# EAGLE design PFC_Method_Lighting+Driver_V2 (EAGLE 9.3.0)
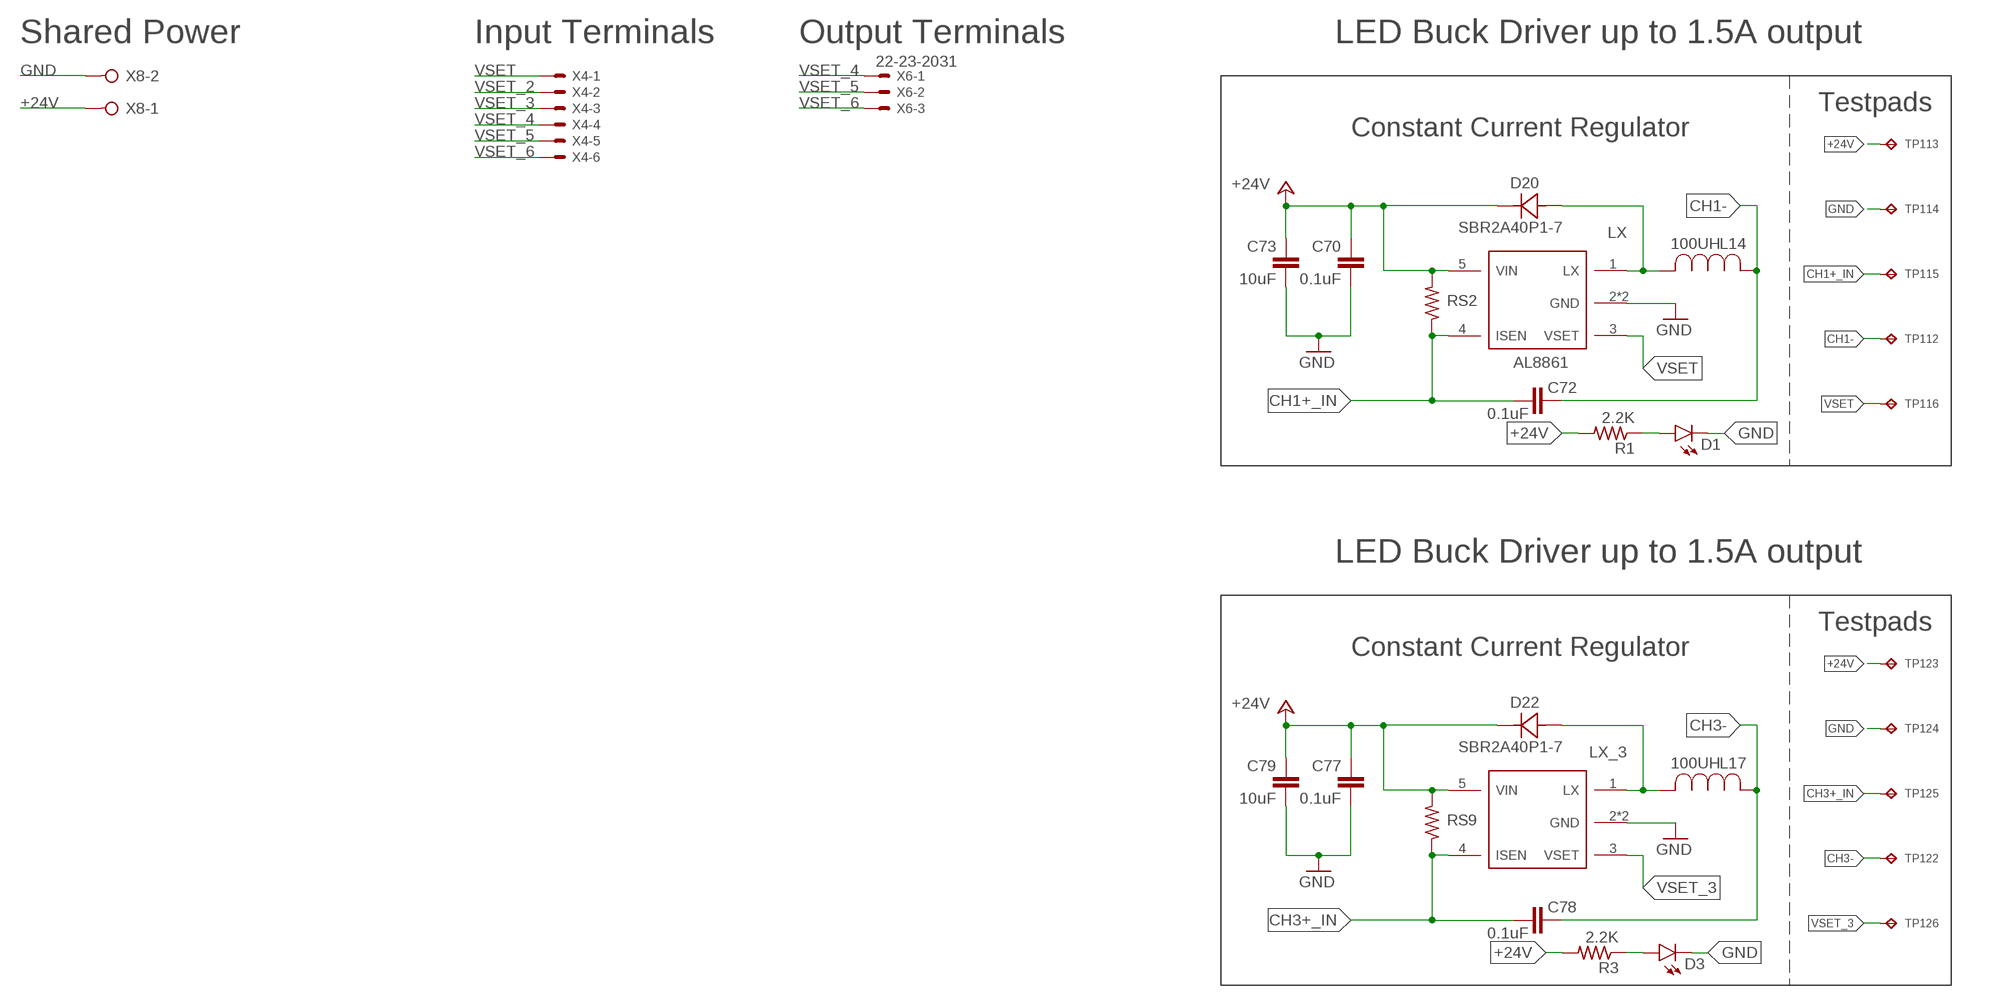
[diagram p0: schematic, sheet 1, part 1 of 2]
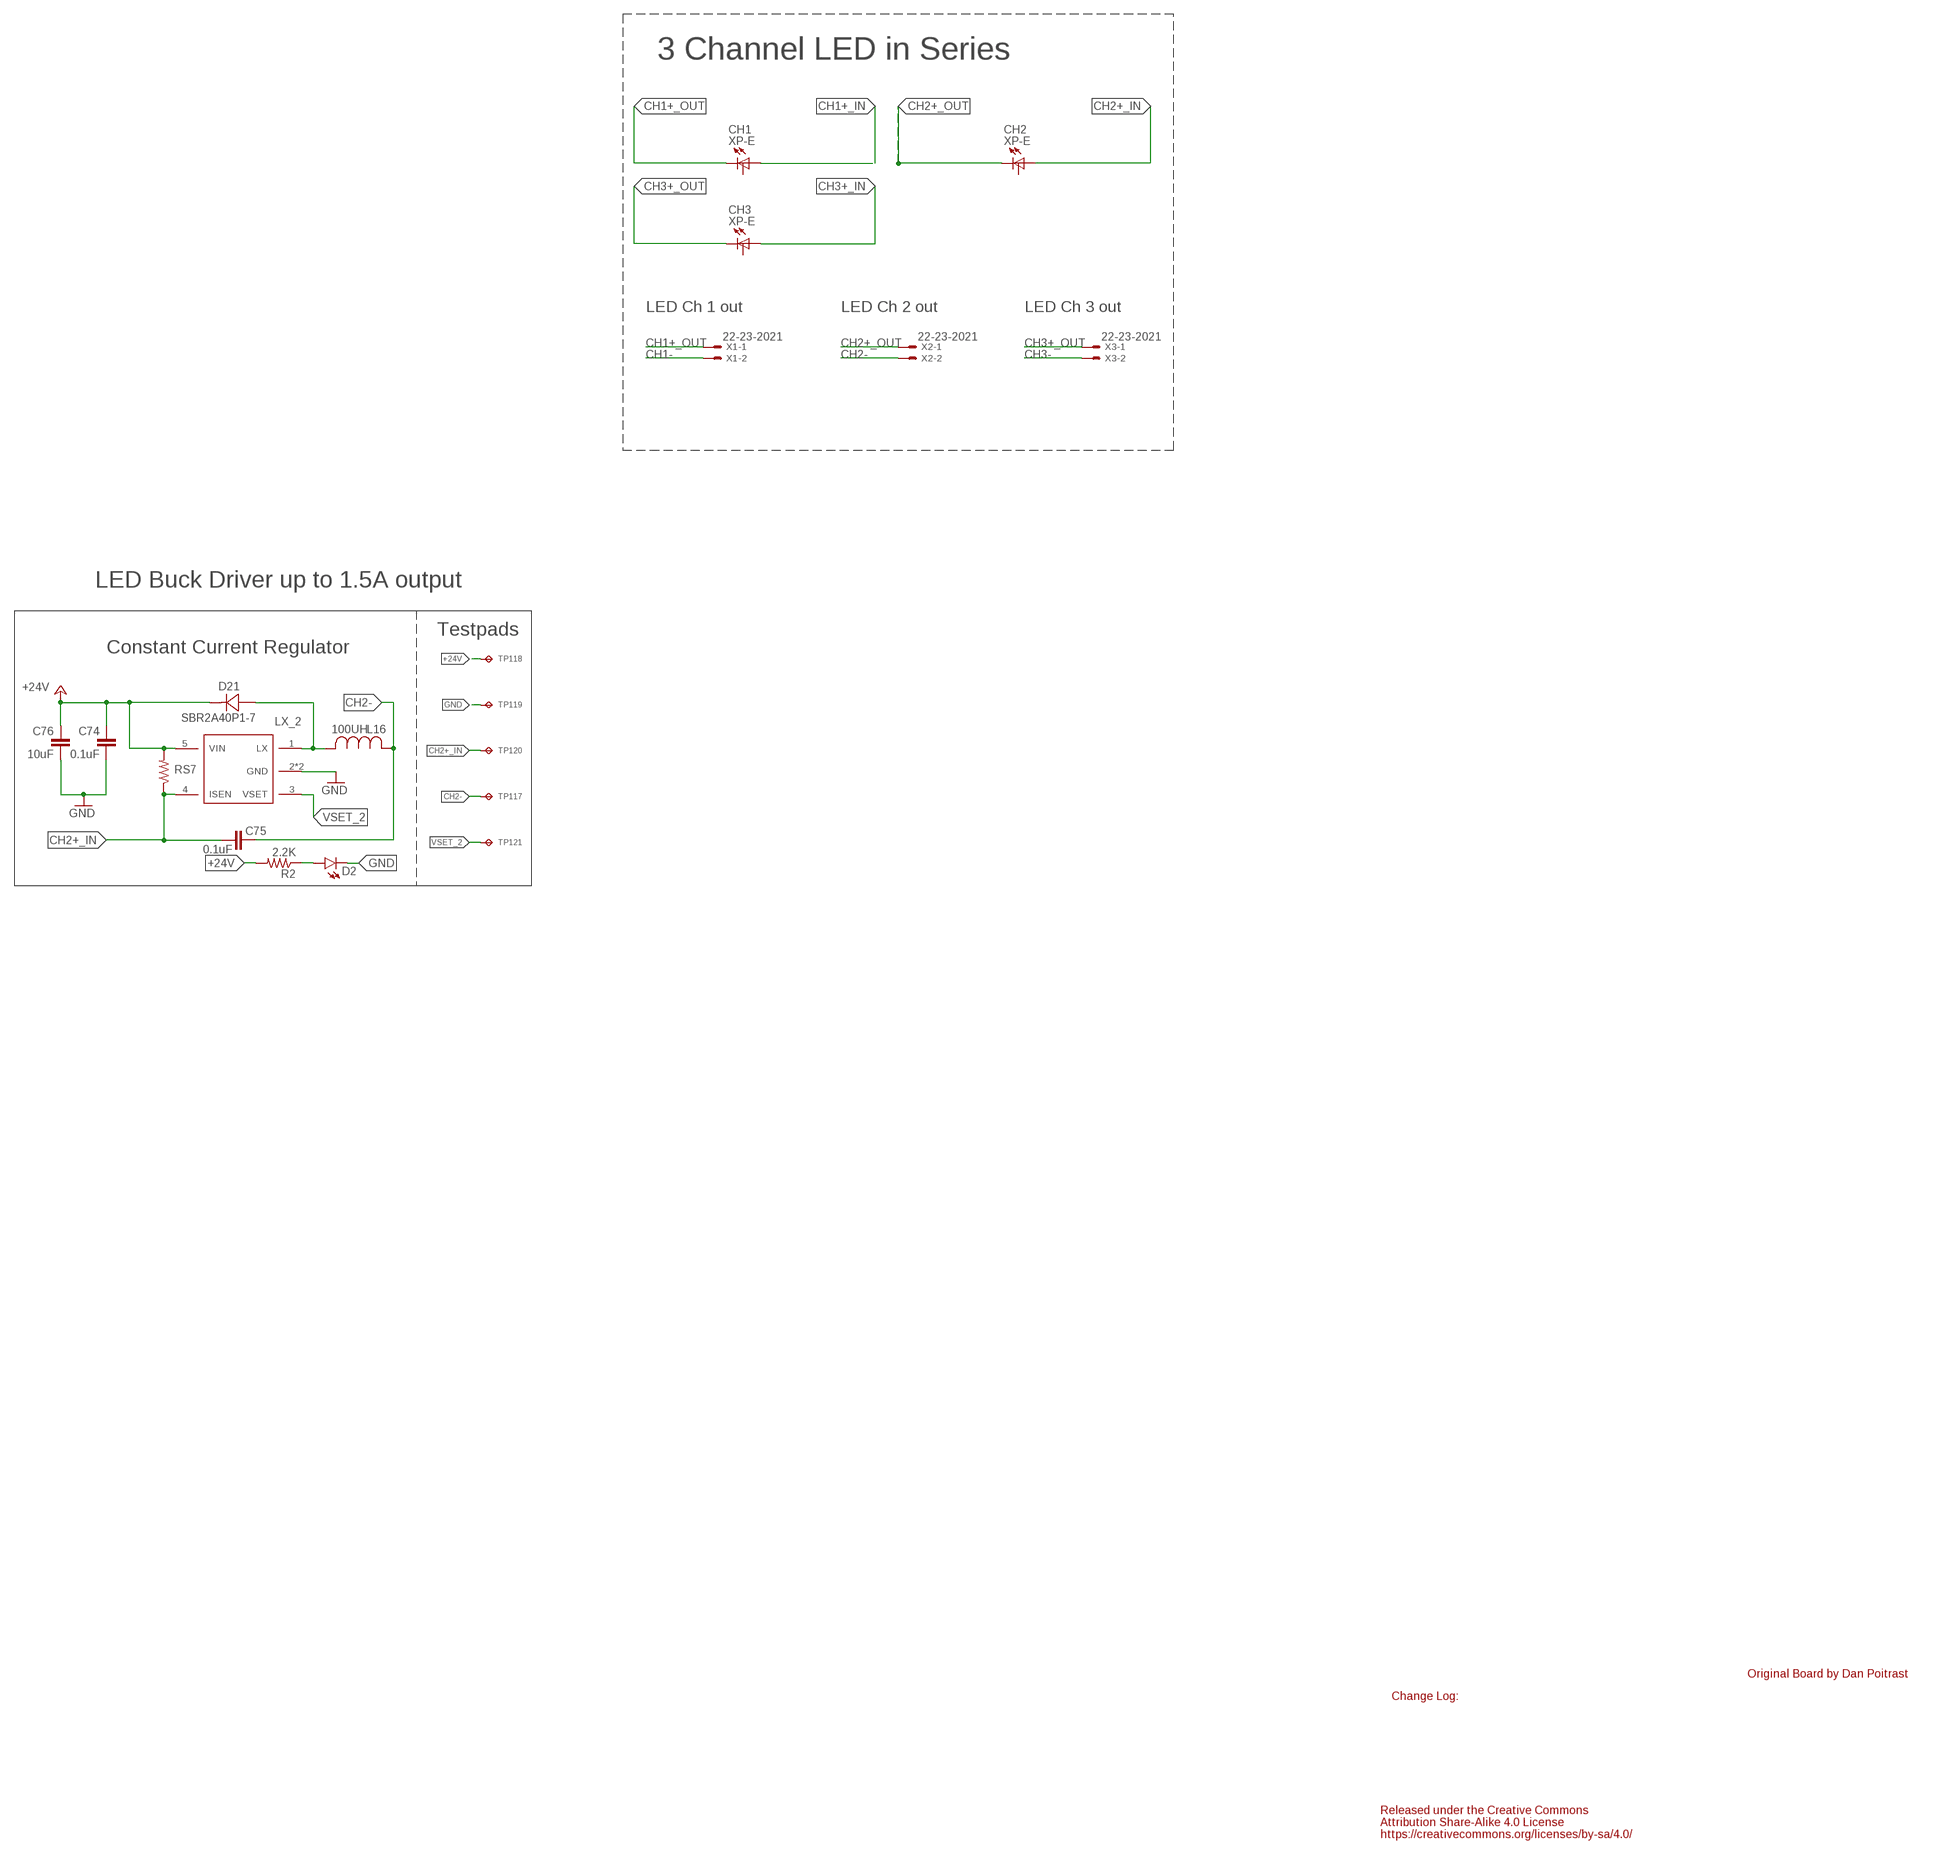
[diagram p1: schematic, sheet 1, part 2 of 2]

## Parts
C70  0.1uF  0.1UF-C0603C104K5RACTU  [C0603]
C72  0.1uF  0.1UF-C0603C104K5RACTU  [C0603]
C73  10uF  10UF-GMK212BBJ106KG-T  [C0805]
C74  0.1uF  0.1UF-C0603C104K5RACTU  [C0603]
C75  0.1uF  0.1UF-C0603C104K5RACTU  [C0603]
C76  10uF  10UF-GMK212BBJ106KG-T  [C0805]
C77  0.1uF  0.1UF-C0603C104K5RACTU  [C0603]
C78  0.1uF  0.1UF-C0603C104K5RACTU  [C0603]
C79  10uF  10UF-GMK212BBJ106KG-T  [C0805]
CH1  XP-E  LED_W/THERM-XP-E  [CREE-XLAMP-XP-E]
CH2  XP-E  LED_W/THERM-XP-E  [CREE-XLAMP-XP-E]
CH3  XP-E  LED_W/THERM-XP-E  [CREE-XLAMP-XP-E]
D1  LED5MM  [LED_5MM]
D2  LED5MM  [LED_5MM]
D3  LED5MM  [LED_5MM]
D20  SBR2A40P1-7  [POWERDI123]
D21  SBR2A40P1-7  [POWERDI123]
D22  SBR2A40P1-7  [POWERDI123]
L14  100UH  100UH_BOURNES  [IND_BOURNS_SDR1307]
L16  100UH  100UH_BOURNES  [IND_BOURNS_SDR1307]
L17  100UH  100UH_BOURNES  [IND_BOURNS_SDR1307]
R1  2.2K  R-US_0207/10  [0207/10]
R2  2.2K  R-US_0207/10  [0207/10]
R3  2.2K  R-US_0207/10  [0207/10]
RS2  6.34Ω  6.3OHM-RC0805FR-076R34L  [R0805]
RS7  6.34 Ω  6.3OHM-RC0805FR-076R34L  [R0805]
RS9  6.34 Ω  6.3OHM-RC0805FR-076R34L  [R0805]
TP112  TPTP06R  [TP06R]
TP113  TPTP06R  [TP06R]
TP114  TPTP06R  [TP06R]
TP115  TPTP06R  [TP06R]
TP116  TPTP06R  [TP06R]
TP117  TPTP06R  [TP06R]
TP118  TPTP06R  [TP06R]
TP119  TPTP06R  [TP06R]
TP120  TPTP06R  [TP06R]
TP121  TPTP06R  [TP06R]
TP122  TPTP06R  [TP06R]
TP123  TPTP06R  [TP06R]
TP124  TPTP06R  [TP06R]
TP125  TPTP06R  [TP06R]
TP126  TPTP06R  [TP06R]
U$25  AL8861  [AL8861]
U$26  AL8861  [AL8861]
U$27  AL8861  [AL8861]
X1  22-23-2021  [22-23-2021]
X2  22-23-2021  [22-23-2021]
X3  22-23-2021  [22-23-2021]
X4  22-23-2061  [22-23-2061]
X6  22-23-2031  [22-23-2031]
X8  W237-02P  [W237-132]

## Nets
+24V: C70.1 C73.1 C74.1 C76.1 C77.1 C79.1 D20.- D21.- D22.- R1.2 R2.2 R3.2 RS2.2 RS7.2 RS9.2 TP113.TP TP118.TP TP123.TP U$25.5(VIN) U$26.5(VIN) U$27.5(VIN) X8.1
CH1+_IN: C72.2 CH1.A CH1.A@1(A) RS2.1 TP115.TP U$25.4(ISEN)
CH1+_OUT: CH1.C CH1.C@1(C) X1.1
CH1-: C72.1 L14.2 TP112.TP X1.2
CH2+_IN: C75.2 CH2.A CH2.A@1(A) RS7.1 TP120.TP U$26.4(ISEN)
CH2+_OUT: CH2.C CH2.C@1(C) X2.1
CH2-: C75.1 L16.2 TP117.TP X2.2
CH3+_IN: C78.2 CH3.A CH3.A@1(A) RS9.1 TP125.TP U$27.4(ISEN)
CH3+_OUT: CH3.C CH3.C@1(C) X3.1
CH3-: C78.1 L17.2 TP122.TP X3.2
GND: C70.2 C73.2 C74.2 C76.2 C77.2 C79.2 D1.K(C) D2.K(C) D3.K(C) TP114.TP TP119.TP TP124.TP U$25.2(GND) U$25.44(GND) U$26.2(GND) U$26.44(GND) U$27.2(GND) U$27.44(GND) X8.2
LX: D20.+ L14.1 U$25.1(LX)
LX_2: D21.+ L16.1 U$26.1(LX)
LX_3: D22.+ L17.1 U$27.1(LX)
N$1: D2.A R2.1
N$2: D1.A R1.1
N$3: D3.A R3.1
VSET: TP116.TP U$25.3(VSET) X4.1
VSET_2: TP121.TP U$26.3(VSET) X4.2
VSET_3: TP126.TP U$27.3(VSET) X4.3
VSET_4: X4.4 X6.1
VSET_5: X4.5 X6.2
VSET_6: X4.6 X6.3
Unconnected: CH1.THERM CH2.THERM CH3.THERM

## Notes on the sheet
- 3 Channel LED in Series
- LED Ch 1 out | LED Ch 2 out | LED Ch 3 out
- Shared Power | Input Terminals | Output Terminals | LED Buck Driver up to 1.5A output | LED Buck Driver up to 1.5A output
- Testpads | Testpads
- Constant Current Regulator | Constant Current Regulator
- AL8861
- LED Buck Driver up to 1.5A output
- Testpads
- Constant Current Regulator
- Original Board by Dan Poitrast
- Change Log:
- Released under the Creative Commons
  Attribution Share-Alike 4.0 License
  https://creativecommons.org/licenses/by-sa/4.0/

## Library data of the parts
C70 C72 C74 C75 C77 C78 = openag-capacitors:0.1UF-C0603C104K5RACTU: CAP CER 0.1UF 50V X7R 0603 Description: 0.1µF ±10% 50V Ceramic Capacitor X7R 0603 (1608 Metric) Technical Specifications: Capacitance: 0.1µF Tolerance: ±10% Rated Voltage: 50V Temperature Coefficient: X7R Operating Temperature: -55°C ~ 125°C Package / Case: 0603 (1608 Metric) Datasheet(s): X7R Dielectric, 6.3-250 VDC <https://search.kemet.com/component-edge/download/datasheet/C0603C104K5RACTU.pdf> Vendor(s): Digikey: 399-5089-1-ND <https://www.digikey.com/product-detail/en/kemet/C0603C104K5RACTU/399-5089-1-ND/1465623>; MANUFACTURER: Kemet; MPN: C0603C104K5RACTU; VENDOR: Digikey; VLINK: https://www.digikey.com/product-detail/en/kemet/C0603C104K5RACTU/399-5089-1-ND/1465623; VPN: 399-5089-1-ND
C73 C76 C79 = openag-capacitors:10UF-GMK212BBJ106KG-T: CAP CER 10UF 35V X5R 0805 Description: 10µF ±10% 35V Ceramic Capacitor X5R 0805 (2012 Metric) Technical Specifications: Capacitance: 10µF Tolerance: ±10% Rated Voltage: 35V Temperature Coefficient: X5R Operating Temperature: -55°C ~ 85°C Package / Case: 0805 (2012 Metric) Datasheet(s): GMK212BBJ106KG-T Spec <http://ds.yuden.co.jp/TYCOMPAS/ut/detail.do?productNo=GMK212BBJ106KG-T&fileName=GMK212BBJ106KG-T_SS&mode=specSheetDownload> Vendor(s): Digikey: 587-4893-1-ND <https://www.digikey.com/product-detail/en/taiyo-yuden/GMK212BBJ106KG-T/587-4893-1-ND/6563736>; MANUFACTURER: Taiyo Yuden; MPN: GMK212BBJ106KG-T; VENDOR: Digikey; VLINK: https://www.digikey.com/product-detail/en/taiyo-yuden/GMK212BBJ106KG-T/587-4893-1-ND/6563736; VPN: 587-4893-1-ND
CH1-CH3 = Tomaszewski:LED_W/THERM
D1-D3 = SparkFun-LED:LED: LED (Generic) Standard schematic elements and footprints for 5mm, 3mm, 1206, and 0603 sized LEDs. Generic LEDs with no color specified.
D20-D22 = openag-diodes:SBR2A40P1-7: DIODE SBR 40V 2A POWERDI123 Description: Diode Super Barrier 40V 2A Surface Mount PowerDI™ 123 Technical Specifications: Diode Type: Super Barrier Voltage - DC Reverse (Vr) (Max): 40V Current - Average Rectified (Io): 2A Voltage - Forward (Vf) (Max) @ If: 500mV @ 2A Speed: Standard Recovery >500ns, > 200mA (Io) Current - Reverse Leakage @ Vr: 100µA @ 40V Mounting Type: Surface Mount Package / Case: POWERDI®123 Supplier Device Package: PowerDI™ 123 Operating Temperature - Junction: -65°C ~ 150°C Base Part Number: SBR2A40 Datasheet(s): SBR2A40P1 <https://www.diodes.com/assets/Datasheets/SBR2A40P1.pdf> Vendor(s): Digikey: SBR2A40P1DITR-ND <https://www.digikey.com/product-detail/en/diodes-incorporated/SBR2A40P1-7/SBR2A40P1DITR-ND/1681825>; MANUFACTURER: Diodes Incorporated; MPN: SBR2A40P1-7; VENDOR: Digikey; VLINK: https://www.digikey.com/product-detail/en/diodes-incorporated/SBR2A40P1-7/SBR2A40P1DITR-ND/1681825; VPN: SBR2A40P1DITR-ND
L14 L16 L17 = openag-inductors:100UH_BOURNES: Bourne - FIXED IND 100UH 1.9A 180 MOHM Technical Specifications: Inductance: 100uH Rated Current: 1.9A Saturation Current: 3.0A DC Resistance: 180mΩ Operating Temperature: -40° C to 125°C Datasheet(s): 100uH Bourne <http://www.bourns.com/docs/Product-Datasheets/SDR1307.pdf> Vendors: Digikey: SDR1307-101KLCT-ND <https://www.digikey.com/product-detail/en/bourns-inc/SDR1307-101KL/SDR1307-101KLCT-ND/3437739>
R1-R3 = rcl:R-US_: RESISTOR, American symbol; SPICEPREFIX: R
RS2 RS7 RS9 = openag-resistors:6.3OHM-RC0805FR-076R34L: Yageo - RC0805FR-076R34L - RES SMD 6.34 OHM 1% 1/8W 0805 Description: 6.34 Ohms ±1% 0.125W, 1/8W Chip Resistor 0805 (2012 Metric) Moisture Resistant Thick Film Technical Specifications: Resistance: 6.34 Ohms Tolerance: ±1% Power: 0.125W, 1/8W Temperature Coefficient: ±200ppm/°C Operating Temperature: -55°C ~ 155°C Packaging / Case: 0805 (2012 Metric) Datasheet(s): RC Series, L Datasheet Vendor(s): Digikey: 311-6.34CRCT-ND <https://www.digikey.com/product-detail/en/yageo/RC0805FR-076R34L/311-6.34CRCT-ND/731003>; POPULATE: YES; VALUE: 6.34 ohm; VERIFIED: NO
TP112-TP126 = openag-testpads:TP: Test pad; MPN: N/A
U$25-U$27 = openag-driver-IC:AL8861: AL8861 LED Driver IC Description: IC LED DRVR REG PWM 1.5A SOT89-5 Technical Specifications: Type: IC Voltage In: 4.5V - 40V Current Out: Up to 1.5A Frequency: 1Mhz Dimming: PWM or Analog Package SOT-89-5 Operating Temperature: -40°C ~ 85°C (TA) Datasheet(s): Diodes AL8861 <https://www.mouser.com/ds/2/115/AL8861-1094677.pdf> Vendor(s): Digikey: Diodes AL8861 <https://www.digikey.com/product-detail/en/diodes-incorporated/AL8861Y-13/AL8861Y-13DICT-ND/6702378>
X1-X3 = con-molex:22-23-2021: .100" (2.54mm) Center Header - 2 Pin; MF: MOLEX; MPN: 22-23-2021; OC_FARNELL: 1462926; OC_NEWARK: 25C3832
X4 = con-molex:22-23-2061: .100" (2.54mm) Center Header - 6 Pin; MF: MOLEX; MPN: 22-23-2061; OC_FARNELL: 1462922; OC_NEWARK: 27C1933
X6 = con-molex:22-23-2031: .100" (2.54mm) Center Header - 3 Pin; MF: MOLEX; MPN: 22-23-2031; OC_FARNELL: 1462950; OC_NEWARK: 30C0862
X8 = con-wago-508:W237-02P: WAGO SREW CLAMP; OC_FARNELL: unknown; OC_NEWARK: unknown

## Net classes
0 default: width 0.305 mm, drill 0.254 mm, clearance 0.254 mm

## Board
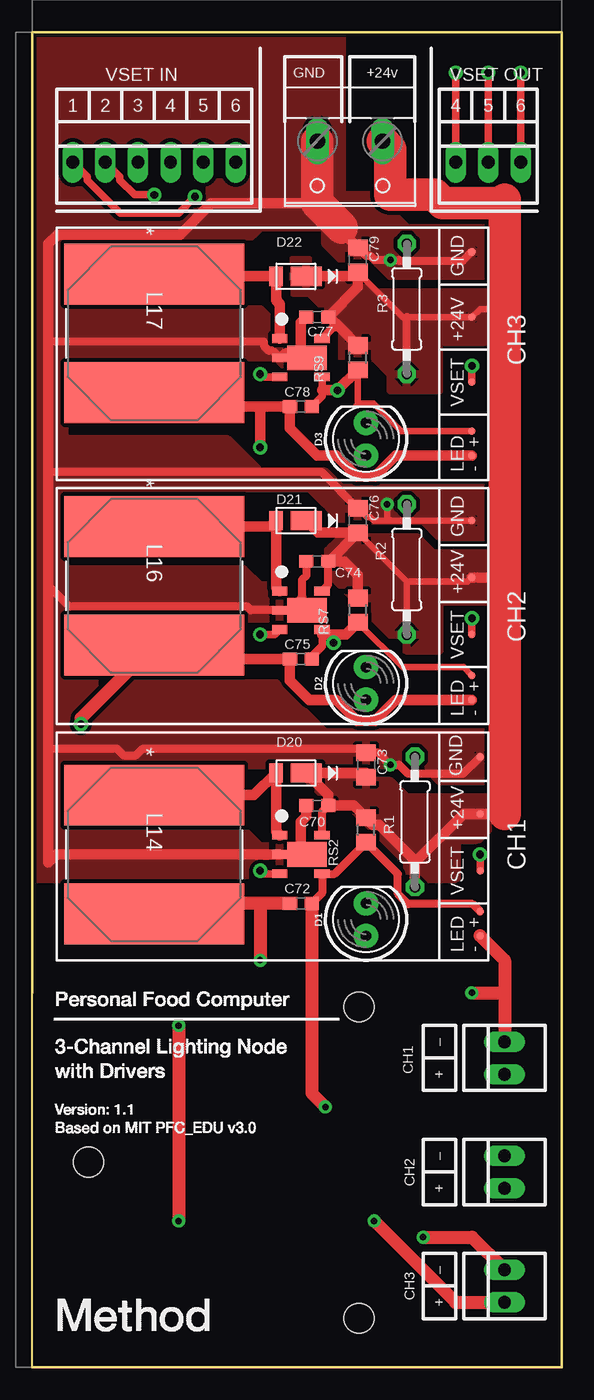
[diagram p2: board, top side]
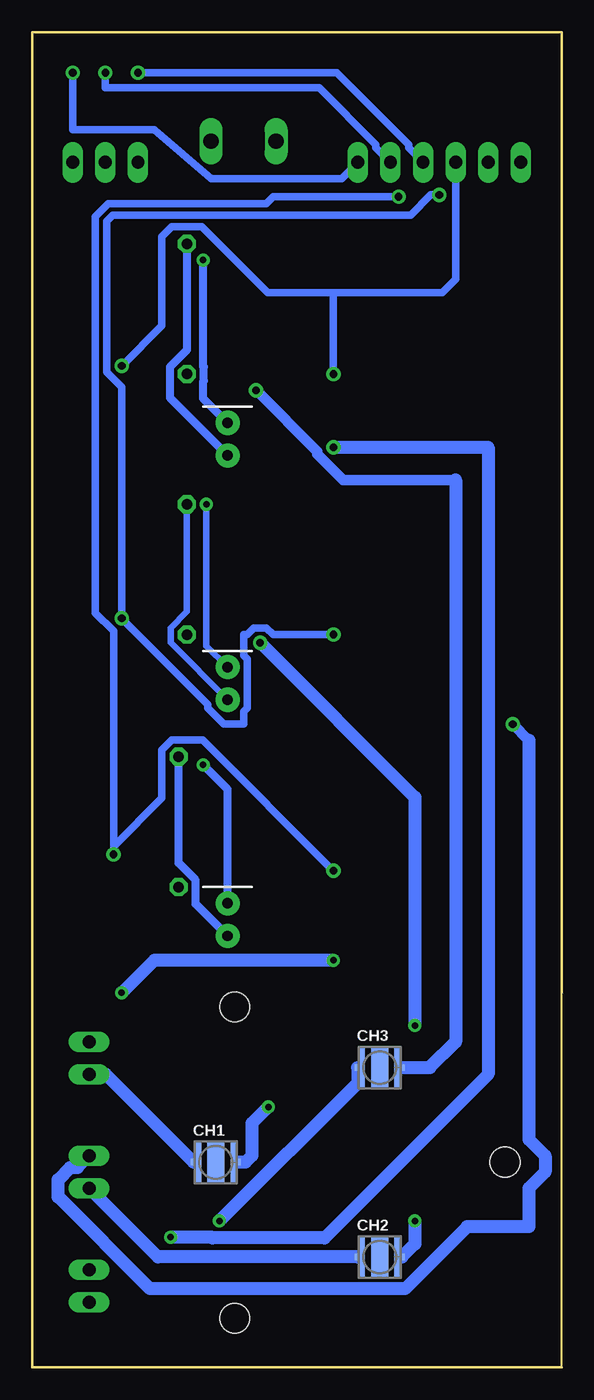
[diagram p3: board, bottom side, seen from below]

Size 41.27 x 104.14 mm. Coordinates in mm from the lower left corner, seen from the top.
Outline: 0,0 0,29.21 0,104.14 41.27,104.14 41.27,0 0,0
Copper layers (1*16): Top 0.035mm / dielectric 1.5mm / Bottom 0.035mm
Design rules "SparkFun *": minimum track width 8mil, minimum drill 20mil, track to track 12mil, track to pad 12mil, pad to pad 12mil, via to via 12mil, smd to smd 8mil, copper to edge 10mil, drill to drill 8mil, minimum pad ring 12mil, minimum via ring 10mil, stop-mask expansion 4mil, vias tented up to drill 25mil, thermal gap 10mil
Holes 2.35 mm at 25.48,28.12 4.39,16 25.48,3.84

### Footprints (pad centres in the part's own frame; a part is rotated, then mirrored left to right if it is on the bottom)
C0603 = smd 1.1 x 1: 1 -0.85,0; 2 0.85,0
C0805 = smd 1.3 x 1.5: 1 -0.95,0; 2 0.95,0
CREE-XLAMP-XP-E = smd 0.5 x 3.3: A 1.4,0; C -1.4,0 | smd 0.45 x 0.5: A@1 1.725,0; C@1 -1.725,0 | smd 1.3 x 3.3: THERM 0,0
LED_5MM = drill 0.813 pad 1.88: A -1.27,0; K 1.27,0
POWERDI123 = smd 1.05 x 1.5: + -1.3,0 | smd 2.4 x 1.5: - 1.05,0
IND_BOURNS_SDR1307 = smd 4.75 x 13.995: 1 -4.623,0; 2 4.623,0
0207/10 = drill 0.813 octagon: 1 -5.08,0; 2 5.08,0
R0805 = smd 1.3 x 1.5: 1 -0.95,0; 2 0.95,0
TP06R = smd 0.6 x 0.6: TP 0,0
AL8861 = smd 0.68 x 1.2: 1 -1.5,-1.65; 2 0,-1.65; 3 1.5,-1.65; 4 1.5,1.65; 5 -1.5,1.65 | smd 1.93 x 3.05: 44 0,0.475
22-23-2021 = drill 1 long: 1 -1.27,0; 2 1.27,0
22-23-2061 = drill 1 long: 1 -6.35,0; 2 -3.81,0; 3 -1.27,0; 4 1.27,0; 5 3.81,0; 6 6.35,0
22-23-2031 = drill 1 long: 1 -2.54,0; 2 0,0; 3 2.54,0
W237-132 = drill 1.194 long: 1 -2.54,-0.635; 2 2.54,-0.635

### Placement (x,y rotation side)
C70  22.23,43.81 180 top
C72  20.95,36.2 0 top
C73  26.04,46.99 90 top
C74  22.23,62.87 180 top
C75  20.95,55.24 0 top
C76  25.4,66.04 90 top
C77  22.23,81.91 180 top
C78  20.95,74.93 0 top
C79  25.4,86.36 90 top
CH1  26.95,16 0 bottom
CH2  14.17,8.61 0 bottom
CH3  14.17,23.39 0 bottom
D1  26.04,34.93 90 top
D2  26.04,53.34 90 top
D3  26.04,72.39 90 top
D20  20.32,46.36 0 top
D21  20.32,66.04 0 top
D22  20.32,85.09 0 top
L14  9.53,40.01 270 top
L16  9.53,60.96 270 top
L17  9.53,80.64 270 top
R1  29.84,42.55 270 top
R2  29.21,62.23 270 top
R3  29.21,82.55 270 top
RS2  26.04,41.91 90 top
RS7  25.4,59.05 90 top
RS9  25.4,78.74 90 top
TP112  34.92,33.66 0 top
TP113  34.29,61.6 90 top
TP114  34.29,66.04 90 top
TP115  34.92,35.56 0 top
TP116  34.92,38.73 0 top
TP117  34.29,52.07 90 top
TP118  34.29,81.91 0 top
TP119  34.29,86.99 0 top
TP120  34.29,53.98 90 top
TP121  34.29,57.15 90 top
TP122  34.29,71.12 0 top
TP123  34.92,43.18 0 top
TP124  34.92,47.62 0 top
TP125  34.29,73.02 0 top
TP126  34.29,76.83 0 top
U$25  20.95,40.01 270 top
U$26  20.95,59.05 270 top
U$27  20.95,78.74 270 top
X1  36.83,24.13 90 top
X2  36.83,15.24 90 top
X3  36.83,6.35 90 top
X4  9.53,93.98 0 top
X6  35.56,93.98 0 top
X8  24.79,95 180 top

### Tracks (layer width: path | path; a pad name or v marks a point on that pad's centre or on a via)
+24V
  Top 0.508: 36.83,82.55 34.92,82.55 TP118.TP 29.21,81.91 28.89,81.91 C79.1 | R2.2 29.21,61.28 | 29.21,61.28 C76.1 | 29.21,61.28 33.98,61.28 TP113.TP
  Top 0.61: R3.2 29.21,81.91 | U$27.5 23.48,81.12 23.97,81.12 | U$26.5 23.07,61.02 C74.1 | U$25.5 22.61,43.34 C70.1
  Top 0.813: C73.1 26.01,46.36 D20.- 23.07,44.65 C70.1 25.08,43.81 RS2.2 26.57,42.32 27.08,42.32 29.84,39.56 29.84,39.37 | D21.- 22.32,65.09 C76.1 23.18,62.87 C74.1 24.34,62.87 25.4,61.81 RS7.2 | C79.1 25.4,85.09 | 25.4,85.09 25.4,84.24 C77.1 23.18,81.91 23.97,81.12 RS9.2 | D22.- 25.4,85.09 | 29.53,37.47 R1.2 29.84,39.37 | 29.84,39.37 33.66,43.18 TP123.TP 36.83,43.18 | TP113.TP 36.2,61.6 36.83,60.96
  Top 2.54: X8.1 27.94,95.02 27.94,91.44 31.39,91.44 32.03,90.8 36.55,90.8 36.83,91.08 36.83,82.55 36.83,60.96 36.83,43.18
  pour Top: 35.56,83.82 26.67,83.82 25.4,85.09 22.86,85.09 21.59,86.36 20.32,86.36 20.32,83.82 21.59,83.82 24.13,81.28 24.13,78.74 26.67,78.74 27.94,77.47 27.94,76.2 31.75,76.2 31.75,80.01 35.56,80.01
  pour Top: 35.56,63.5 35.56,59.69 31.75,59.69 31.75,55.88 29.21,55.88 26.67,58.42 26.67,59.69 25.4,59.69 22.86,62.23 22.86,63.5 24.13,64.77 29.97,64.77 31.24,63.5
  pour Top: 35.56,44.45 31.75,44.45 29.21,44.45 27.94,45.72 21.59,45.72 22.86,44.45 24.13,44.45 25.4,43.18 29.21,39.37 29.21,38.1 33.02,38.1 33.15,38.23 33.15,41.15 34.8,41.15 35.56,41.91
CH1+_IN  (via drill 0.51)
  Top 0.61: TP115.TP 34.34,36.14 29.3,36.14 28.51,36.93 28.51,38.48 RS2.1 23.58,38.51 U$25.4 22.61,36.99 C72.2
  Top 1.016: C72.2 21.8,21.38 v22.86,20.32
  Bottom 1.016: v22.86,20.32 24.13,19.05 24.13,16.51 24.64,16 CH1.A@1
CH1+_OUT
  Bottom 0.6: CH1.C CH1.C@1
  Bottom 1.016: CH1.C@1 35.53,22.86 X1.1
CH1-  (via drill 0.51)
  Top 0.813: L14.2 10.34,36.2 12.7,36.2
  Top 1.016: C72.1 17.78,36.2 | 17.78,36.2 12.7,36.2 | TP112.TP 36.83,31.75 36.83,29.21 | 36.83,29.21 X1.2 | 17.78,36.2 v17.78,31.75 | v34.29,29.21 36.83,29.21
  Bottom 1.016: v17.78,31.75 31.75,31.75 v34.29,29.21
CH2+_IN  (via drill 0.51, 0.6)
  Top 0.508: TP120.TP 33.66,54.61 28.89,54.61 RS7.1
  Top 0.6: U$26.4 22.61,57.15 22.61,56.26
  Top 0.61: C75.2 21.8,55.46 22.61,56.26
  Top 0.813: RS7.1 24.45,57.15 23.5,57.15 | 23.5,57.15 22.61,57.15 | 23.5,57.15 v23.5,56.52
  Top 1.016: v11.43,26.67 v11.43,11.43
  Bottom 1.016: v23.5,56.52 11.43,44.45 v11.43,26.67 | v11.43,11.43 11.43,9.63 CH2.A@1
CH2+_OUT
  Bottom 1.016: CH2.C@1 31.47,8.61 X2.1
CH2-  (via drill 0.6)
  Top 0.813: L16.2 10.62,55.24 C75.1 20.11,53.55 21.59,52.07 23.7,52.07 25.35,50.42 26.72,50.42 28.37,52.07 TP117.TP | 3.81,50.62 v3.81,50.16
  Top 1.016: L16.2 3.81,50.62
  Bottom 0.813: v3.81,50.16 2.54,48.9
  Bottom 1.016: 2.54,48.9 2.54,17.78 1.27,16.51 1.27,15.24 2.54,13.97 2.54,10.98 7.35,10.98 12.19,6.15 32.1,6.15 39.25,13.3 39.25,14.64 38.3,15.59 37.75,15.59 X2.2
CH3+_IN  (via drill 0.6)
  Top 0.508: RS9.1 25.4,75.14 | 25.4,75.14 25.29,75.04 | 25.4,75.14 25.41,75.16 26.66,75.16 28.79,73.02 TP125.TP
  Top 0.6: U$27.4 22.61,76.2 22.61,75.73 C78.2
  Top 0.813: RS9.1 v23.81,76.2 22.61,76.2
  Bottom 0.813: v23.81,76.2 19.05,71.43 19.05,71.23 17.03,69.21 8.26,69.21
  Bottom 1.016: 8.26,69.21 8.26,25.4 | 8.26,25.4 8.26,25.37 | CH3.A@1 10.26,23.39 8.26,25.4
CH3+_OUT  (via drill 0.51)
  Top 1.016: v26.67,11.43 33.02,5.08 X3.1
  Bottom 1.016: CH3.C@1 15.9,22.2 v26.67,11.43
CH3-  (via drill 0.51, 0.6)
  Top 0.813: L17.2 14.78,76.02 15.88,74.93 17.78,74.93 | 17.78,74.93 C78.1 20.11,73.24 22.23,71.12 23.7,71.12 25.35,69.47 26.72,69.47 28.37,71.12 TP122.TP | 17.78,74.93 v17.78,71.75
  Top 1.016: v30.48,10.16 34.29,10.16 X3.2
  Bottom 1.016: v17.78,71.75 5.71,71.75 5.71,22.86 18.47,10.11 27.22,10.11 27.27,10.16 v30.48,10.16
GND  (via drill 0.51)
  Top 0.508: TP114.TP 27.94,66.04 | 27.94,66.04 26.64,66.04 26.38,66.3 26.09,66.3 C76.2 | v27.69,67.31 27.69,66.29 27.94,66.04
  Top 0.61: 1.27,60.96 2.91,59.32 16.77,59.32 17.04,59.05 U$26.2 U$26.44 21.43,59.22 20.83,59.82 21.08,60.07 21.08,61.47 21.38,61.76 C74.2 | 1.27,69.85 22.54,69.85 C76.2 | 1.27,48.26 6.61,48.26 7.14,47.73 8.1,47.73 8.63,48.26 25.71,48.26 C73.2 26.99,47.94 v27.94,46.99 28.61,46.99 29.3,46.3 33.6,46.3 TP124.TP | C79.2 26.04,86.67 26.4,86.67 26.71,86.36 v27.94,86.36 28.61,86.36 28.66,86.31 33.6,86.31 TP119.TP | 1.27,80.01 18.04,80.01 18.09,79.95 18.09,79.65 18.45,79.29 18.75,79.29 U$27.2 19.78,79.21 20.95,79.21 | U$25.2 U$25.44 21.43,40.16 20.95,40.64
  Top 0.813: C70.2 21.38,42.97 20.95,42.55 20.95,40.64 | C77.2 20.95,81.49 20.95,79.21 U$27.44 | C79.2 24.13,88.58 24.13,88.9 | 22.25,90.78 13.97,90.78 11.55,88.35 1.99,88.35 1.27,87.63 1.27,80.01 1.27,69.85 1.27,60.96 1.27,48.26 1.27,39.37 1.91,40.01 U$25.2
  Top 2.54: X8.2 22.25,90.78 24.13,88.9
  Bottom 0.508: D2.K 27.69,56.26 v27.69,67.31
  Bottom 0.61: D3.K 27.94,75.56 27.94,76.87 27.89,76.92 27.89,78.02 27.94,78.07 v27.94,86.36 | D1.K 26.04,45.09 v27.94,46.99
  pour Top: 0,104.14 24.13,104.14 24.13,88.9 17.78,88.9 16.51,87.63 2.54,87.63 2.54,82.55 17.78,82.55 20.32,80.01 20.32,77.47 19.05,78.74 15.24,78.74 2.54,78.74 0,78.74
  pour Top: 0,80.01 0,38.1 20.32,38.1 20.32,40.64 17.78,40.64 16.51,41.91 2.54,41.91 2.54,46.99 26.67,46.99 30.48,46.99 31.75,45.72 35.56,45.72 35.56,49.53 22.86,49.53 19.05,53.34 2.54,53.34 2.54,58.42 20.32,58.42 20.32,60.96 17.78,60.96 16.51,62.23 2.54,62.23 2.54,68.58 21.59,68.58 24.13,66.04 30.48,66.04 31.75,64.77 35.56,64.77 35.56,68.58 24.13,68.58 22.86,69.85 17.78,69.85 15.24,72.39 2.54,72.39 2.54,80.01
  pour Top: 24.13,91.44 26.67,91.44 29.21,88.9 35.56,88.9 35.56,85.09 27.94,85.09 26.67,86.36 24.13,86.36 22.86,87.63 22.86,91.44
LX
  Top 0.813: U$25.1 19.02,41.79 D20.+ 17.29,44.63 L14.1
LX_2
  Top 0.813: L16.1 18.56,65.58 D21.+ 19.02,60.84 U$26.1
LX_3
  Top 0.813: L17.1 9.7,85.09 D22.+ 19.02,83.21 19.3,82.93 U$27.1
N$1
  Bottom 0.508: R2.1 29.21,58.95 30.48,57.68 30.48,56.52 D2.A
N$2
  Bottom 0.61: D1.A 28.52,36.14 28.52,38.01 29.84,39.33 R1.1
N$3
  Bottom 0.61: R3.1 29.21,79.34 30.53,78.02 30.53,75.62 D3.A
VSET  (via drill 0.6)
  Top 0.6: U$25.3 18.01,38.51 v17.78,38.73 | v34.92,40.01 TP116.TP | X4.1 4.3,92.85 4.3,92.59 6.87,90.03 11.43,90.03 v12.7,91.3
  Bottom 0.6: 34.92,40.64 34.92,57.42 36.35,58.84 36.35,89.75 35.35,90.76 23,90.76 22.46,91.3 v12.7,91.3 | 34.92,40.64 31.16,44.4 31.16,48.17 30.39,48.94 27.99,48.94 v17.78,38.73 | v34.92,40.01 34.92,40.64
VSET_2  (via drill 0.6)
  Top 0.6: U$26.3 18.9,57.15 v17.78,57.15 | v34.29,58.42 TP121.TP | X4.2 6.84,92.85 6.84,92.59 8,91.44 v9.53,91.44
  Bottom 0.6: v17.78,57.15 22.49,57.15 23.02,57.67 23.98,57.67 24.5,57.15 24.77,57.15 24.77,55.52 24.49,55.25 24.49,51.43 24.77,51.16 24.77,50.16 26.31,50.16 27.58,51.43 27.58,51.71 v34.29,58.42 34.29,76.47 35.45,77.62 35.45,89.38 34.98,89.85 11.77,89.85 10.18,91.44 v9.53,91.44
VSET_3  (via drill 0.6)
  Top 0.6: U$27.3 18.01,77.24 v17.78,77.47 | v34.29,78.1 TP126.TP
  Bottom 0.6: 17.78,83.82 v17.78,77.47 | X4.3 8.26,84.87 9.3,83.82 17.78,83.82 | 17.78,83.82 22.9,83.82 28.03,88.95 30.39,88.95 31.16,88.17 31.16,81.23 v34.29,78.1
VSET_4  (via drill 0.6)
  Top 0.6: v33.02,100.96 X6.1
  Bottom 0.6: X4.4 11.93,95.11 11.93,95.37 17.52,100.96 v33.02,100.96
VSET_5  (via drill 0.6)
  Top 0.6: v35.56,100.96 X6.2
  Bottom 0.6: X4.5 14.46,95.11 14.46,95.37 18.9,99.81 35.56,99.81 v35.56,100.96
VSET_6  (via drill 0.6)
  Top 0.6: v38.1,100.96 X6.3
  Bottom 0.6: v38.1,100.96 38.1,96.52 31.75,96.52 27.3,92.71 17.14,92.71 X4.6

### Text on the board
tPlace: GND | +24v | VSET IN | VSET OUT | 1 | 2 | 3 | 4 | 5 | 6 | 4 | 5 | 6 | GND | +24V | CH3 | VSET | + | LED | - | GND | +24V | CH2 | VSET | + | LED | - | GND | +24V | CH1 | VSET | + | LED | - | – | CH1 | + | – | CH2 | + | – | CH3 | +